# EAGLE schematic pork pi (EAGLE 6.5.0)
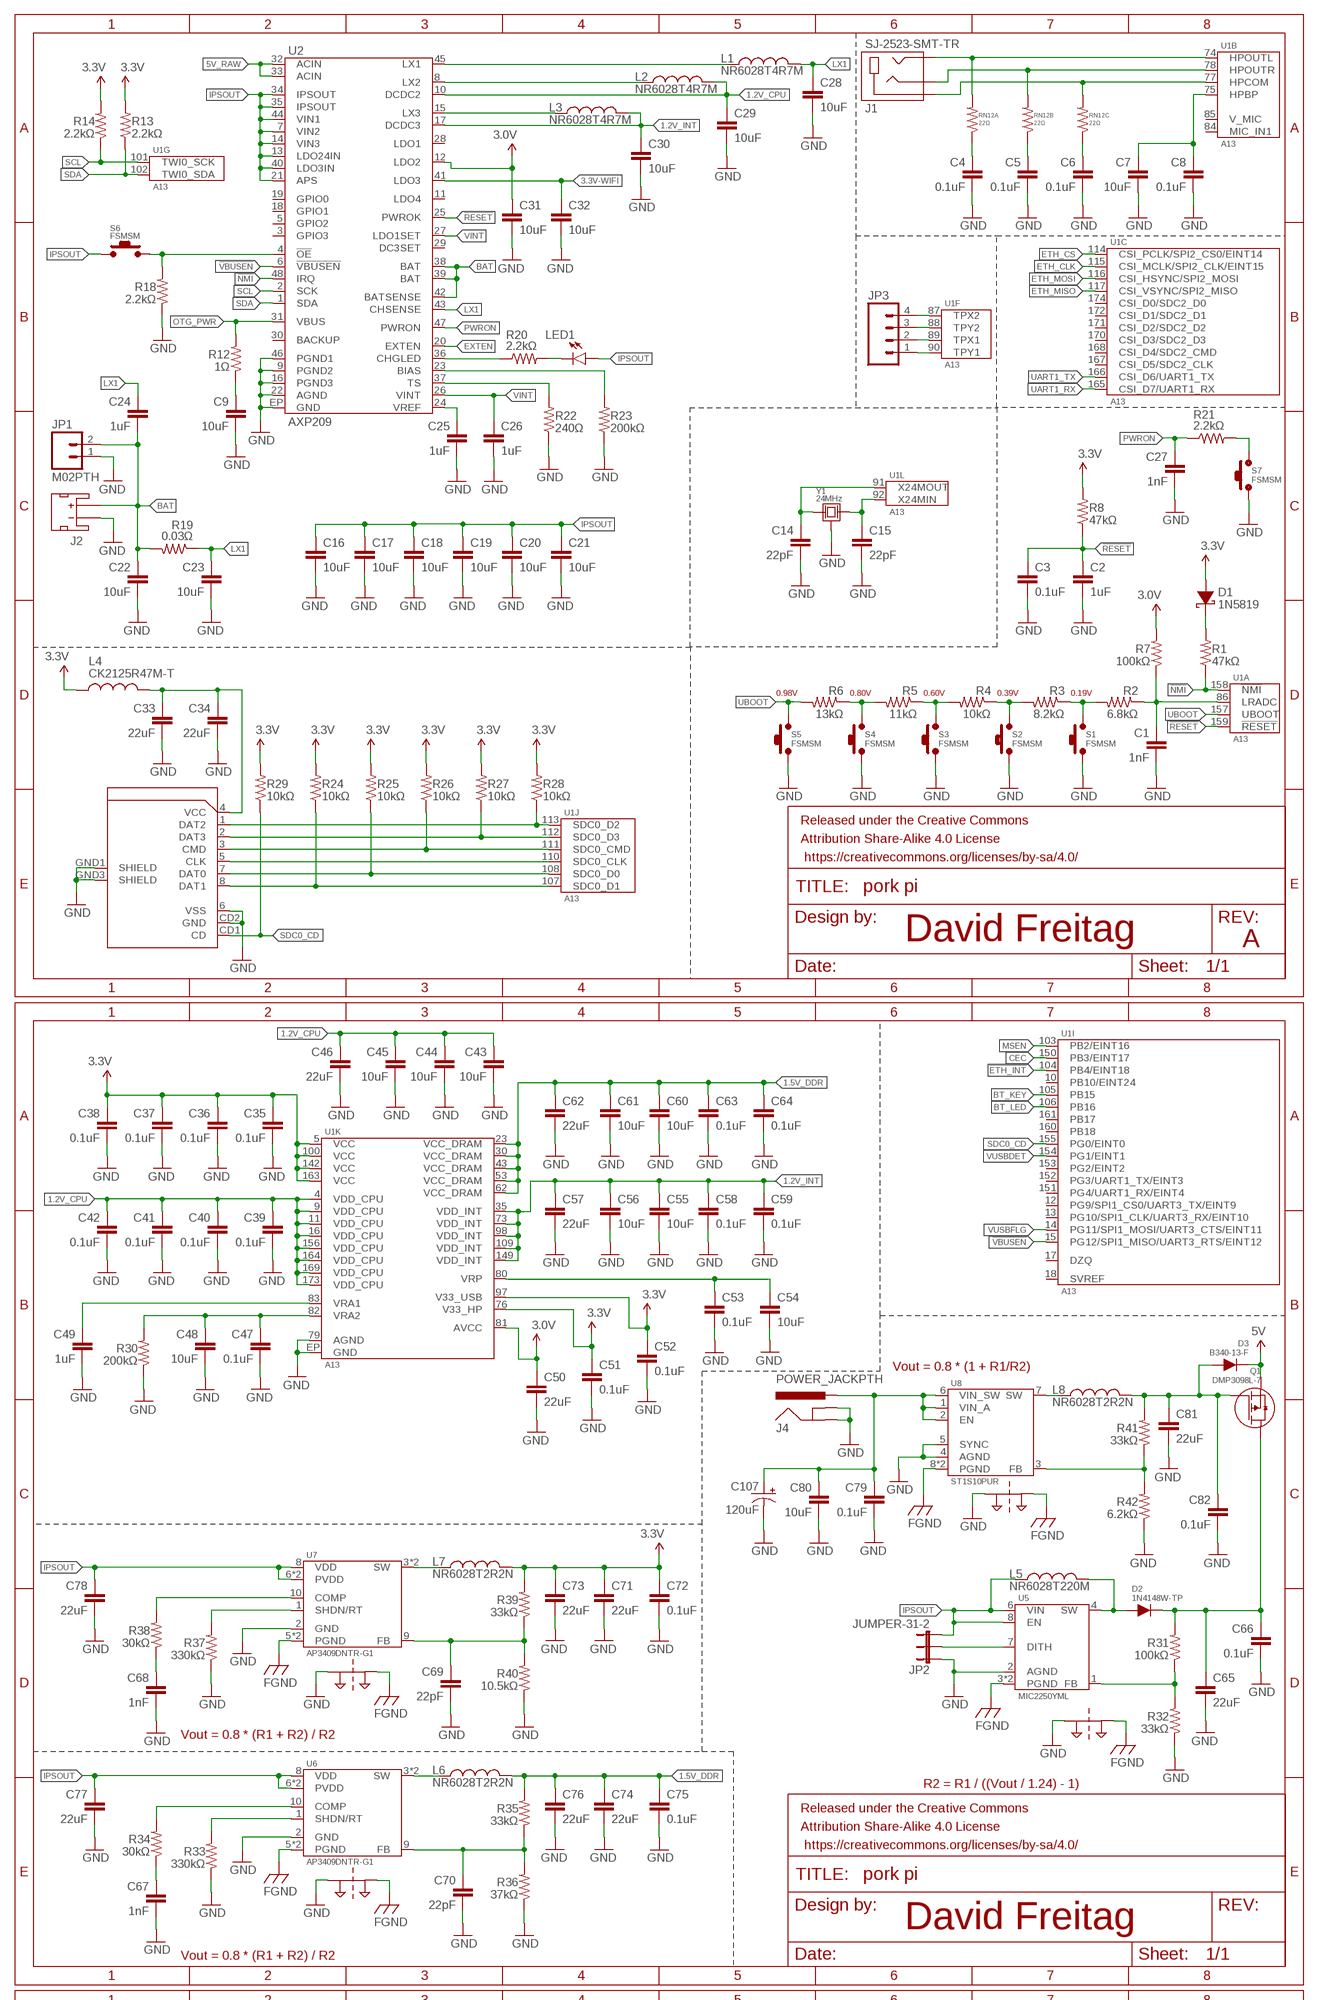
[diagram p0: schematic, sheet 1, part 1 of 3]
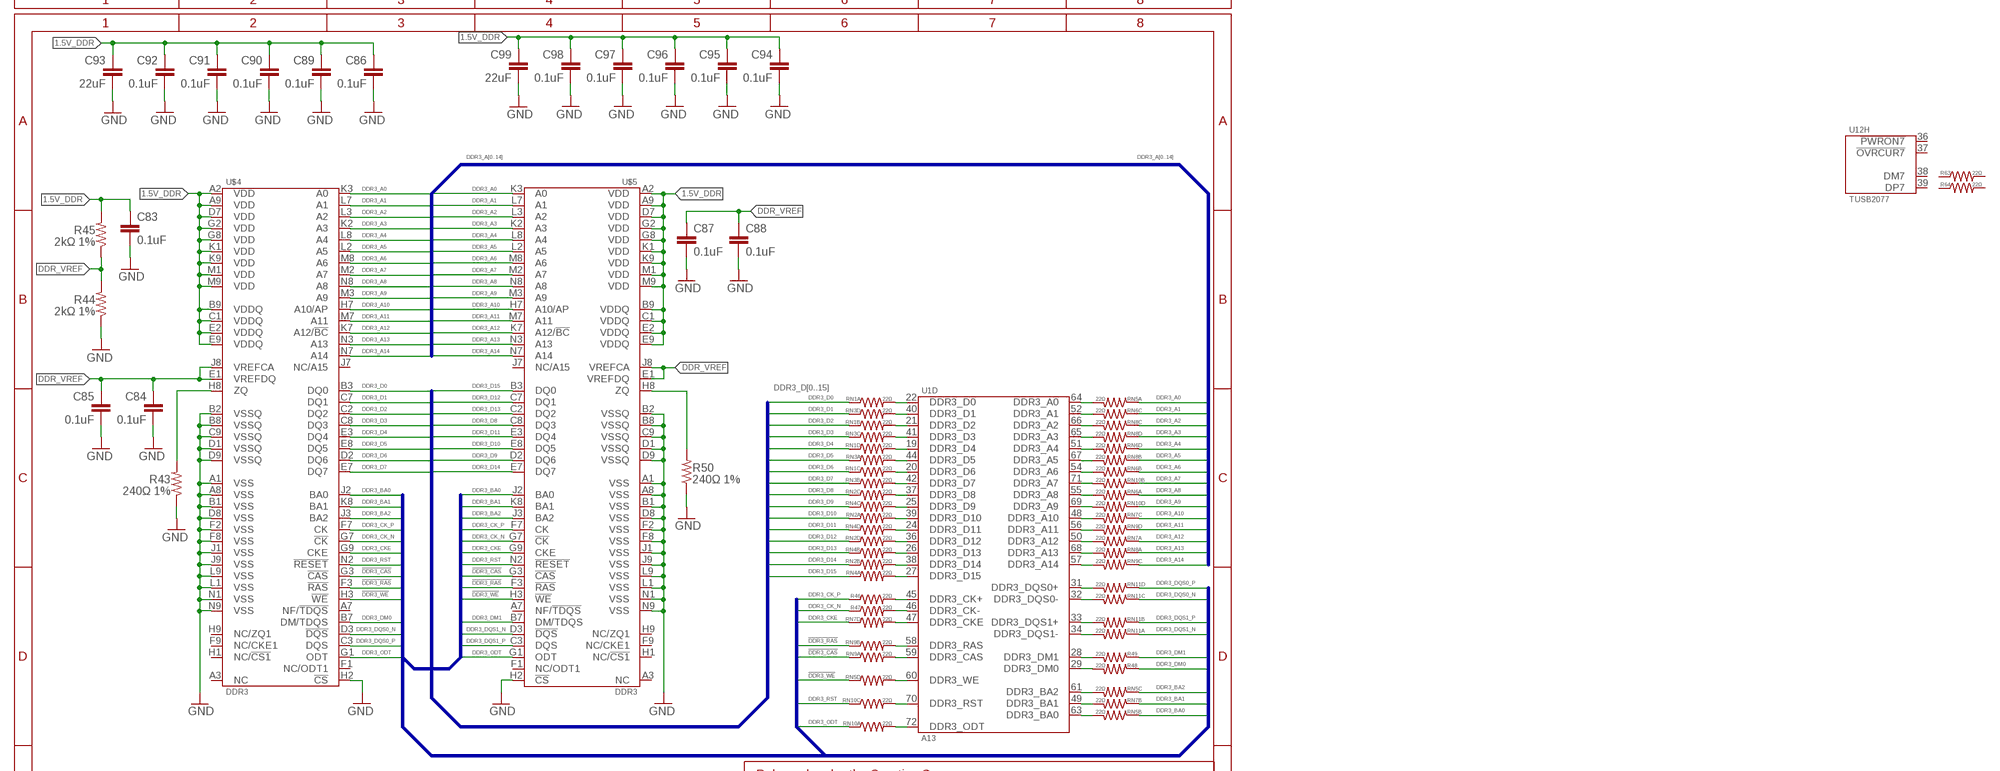
[diagram p1: schematic, sheet 1, part 2 of 3]
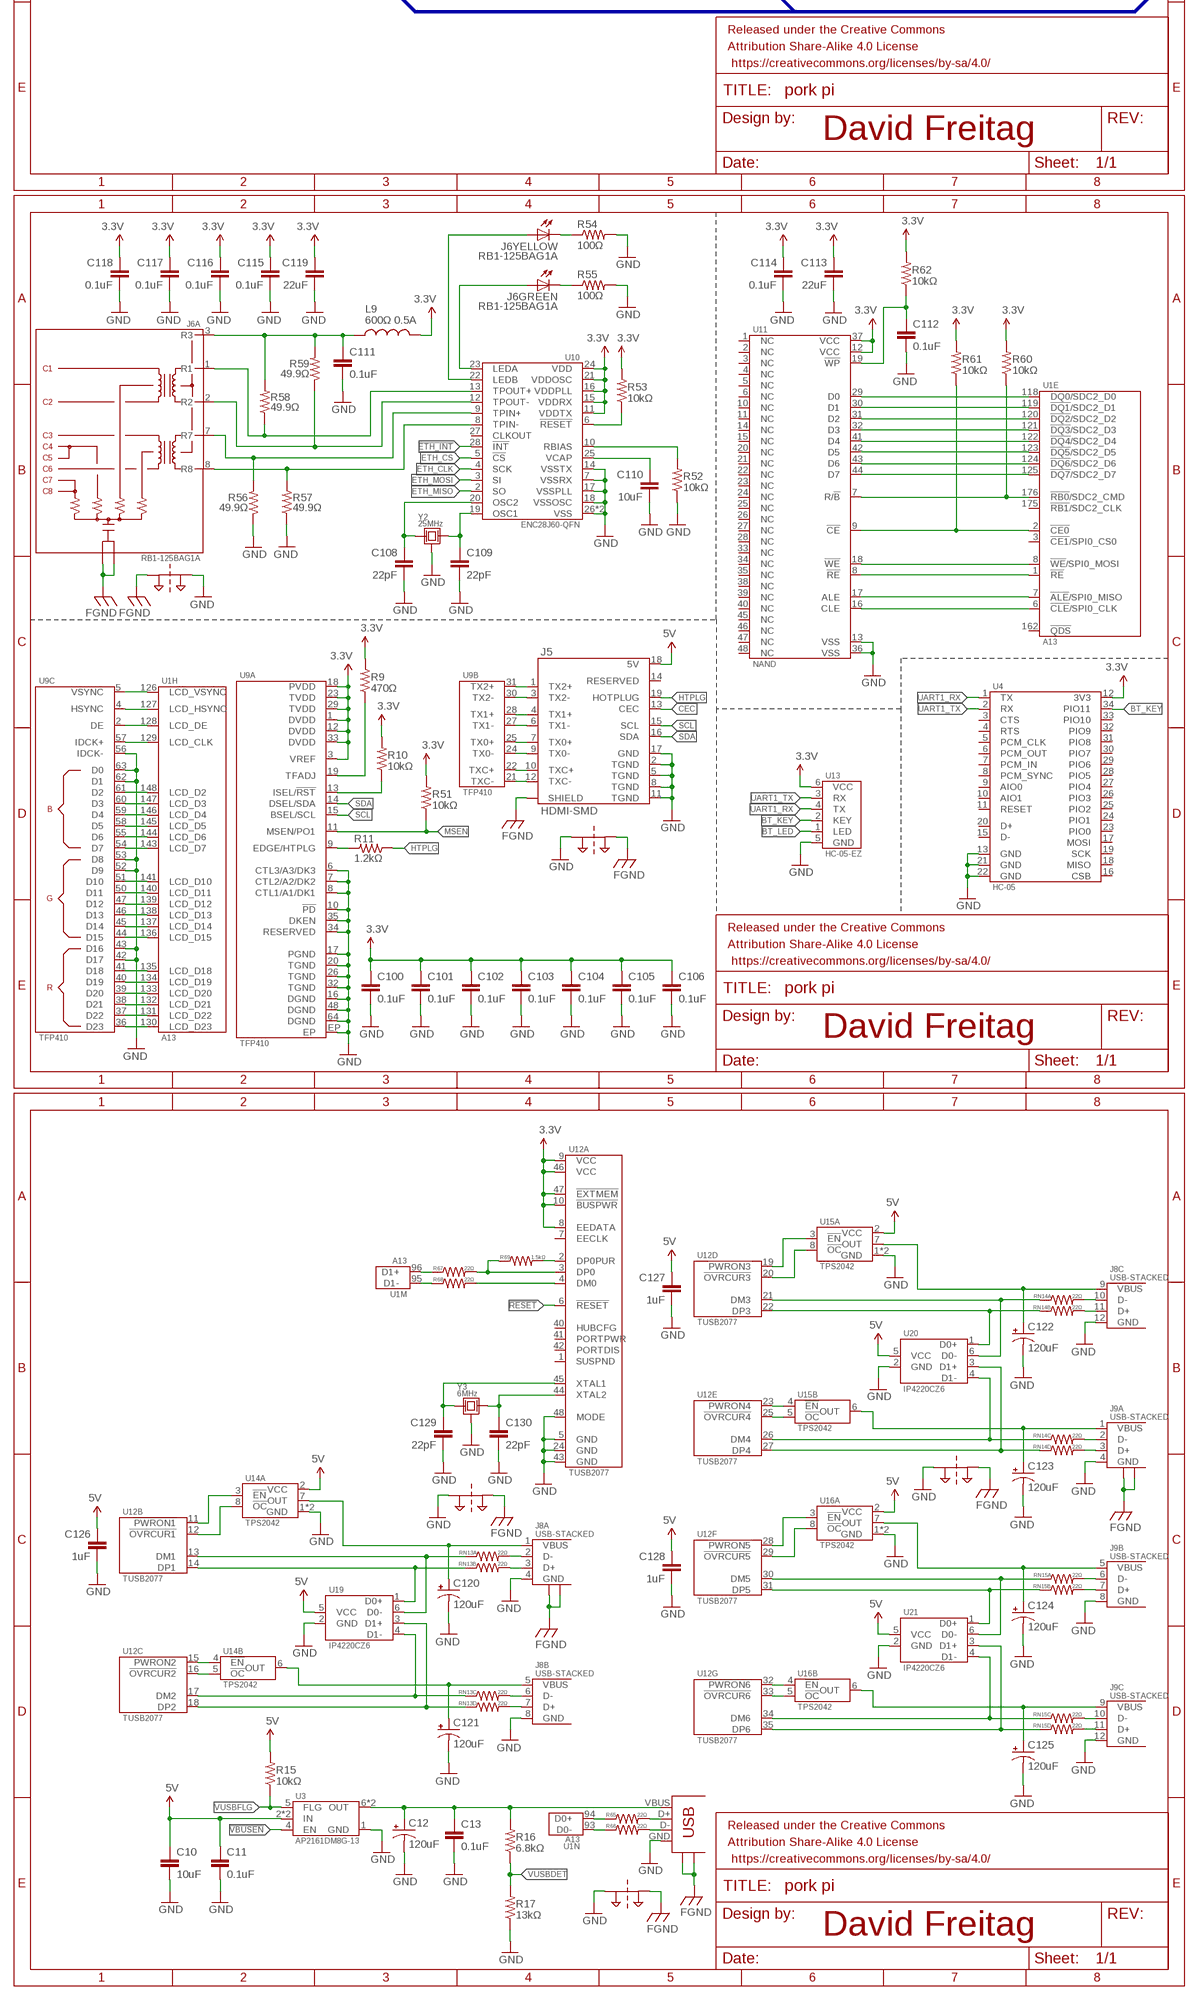
[diagram p2: schematic, sheet 1, part 3 of 3]

## Parts
C1  1nF  CAP0402-CAP  [0402-CAP]
C2  1uF  CAP0402-CAP  [0402-CAP]
C3  0.1uF  CAP0402-CAP  [0402-CAP]
C4  0.1uF  CAP0402-CAP  [0402-CAP]
C5  0.1uF  CAP0402-CAP  [0402-CAP]
C6  0.1uF  CAP0402-CAP  [0402-CAP]
C7  10uF  CAP0603-CAP  [0603-CAP]
C8  0.1uF  CAP0402-CAP  [0402-CAP]
C9  10uF  CAP0603-CAP  [0603-CAP]
C10  10uF  CAP0603-CAP  [0603-CAP]
C11  0.1uF  CAP0402-CAP  [0402-CAP]
C12  120uF  CAP_POL-POLYMER_6.5  [CAP_POLYMER-6.5X6.5]
C13  0.1uF  CAP0402-CAP  [0402-CAP]
C14  22pF  CAP0402-CAP  [0402-CAP]
C15  22pF  CAP0402-CAP  [0402-CAP]
C16  10uF  CAP0603-CAP  [0603-CAP]
C17  10uF  CAP0603-CAP  [0603-CAP]
C18  10uF  CAP0603-CAP  [0603-CAP]
C19  10uF  CAP0603-CAP  [0603-CAP]
C20  10uF  CAP0603-CAP  [0603-CAP]
C21  10uF  CAP0603-CAP  [0603-CAP]
C22  10uF  CAP0603-CAP  [0603-CAP]
C23  10uF  CAP0603-CAP  [0603-CAP]
C24  1uF  CAP0402-CAP  [0402-CAP]
C25  1uF  CAP0402-CAP  [0402-CAP]
C26  1uF  CAP0402-CAP  [0402-CAP]
C27  1nF  CAP0402-CAP  [0402-CAP]
C28  10uF  CAP0603-CAP  [0603-CAP]
C29  10uF  CAP0603-CAP  [0603-CAP]
C30  10uF  CAP0603-CAP  [0603-CAP]
C31  10uF  CAP0603-CAP  [0603-CAP]
C32  10uF  CAP0603-CAP  [0603-CAP]
C33  22uF  CAP0603-CAP  [0603-CAP]
C34  22uF  CAP0603-CAP  [0603-CAP]
C35  0.1uF  CAP0402-CAP  [0402-CAP]
C36  0.1uF  CAP0402-CAP  [0402-CAP]
C37  0.1uF  CAP0402-CAP  [0402-CAP]
C38  0.1uF  CAP0402-CAP  [0402-CAP]
C39  0.1uF  CAP0402-CAP  [0402-CAP]
C40  0.1uF  CAP0402-CAP  [0402-CAP]
C41  0.1uF  CAP0402-CAP  [0402-CAP]
C42  0.1uF  CAP0402-CAP  [0402-CAP]
C43  10uF  CAP0603-CAP  [0603-CAP]
C44  10uF  CAP0603-CAP  [0603-CAP]
C45  10uF  CAP0603-CAP  [0603-CAP]
C46  22uF  CAP0603-CAP  [0603-CAP]
C47  0.1uF  CAP0402-CAP  [0402-CAP]
C48  10uF  CAP0603-CAP  [0603-CAP]
C49  1uF  CAP0402-CAP  [0402-CAP]
C50  22uF  CAP0603-CAP  [0603-CAP]
C51  0.1uF  CAP0402-CAP  [0402-CAP]
C52  0.1uF  CAP0402-CAP  [0402-CAP]
C53  0.1uF  CAP0402-CAP  [0402-CAP]
C54  10uF  CAP0603-CAP  [0603-CAP]
C55  10uF  CAP0603-CAP  [0603-CAP]
C56  10uF  CAP0603-CAP  [0603-CAP]
C57  22uF  CAP0603-CAP  [0603-CAP]
C58  0.1uF  CAP0402-CAP  [0402-CAP]
C59  0.1uF  CAP0402-CAP  [0402-CAP]
C60  10uF  CAP0603-CAP  [0603-CAP]
C61  10uF  CAP0603-CAP  [0603-CAP]
C62  22uF  CAP0603-CAP  [0603-CAP]
C63  0.1uF  CAP0402-CAP  [0402-CAP]
C64  0.1uF  CAP0402-CAP  [0402-CAP]
C65  22uF  CAP0603-CAP  [0603-CAP]
C66  0.1uF  CAP0402-CAP  [0402-CAP]
C67  1nF  CAP0402-CAP  [0402-CAP]
C68  1nF  CAP0402-CAP  [0402-CAP]
C69  22pF  CAP0402-CAP  [0402-CAP]
C70  22pF  CAP0402-CAP  [0402-CAP]
C71  22uF  CAP0603-CAP  [0603-CAP]
C72  0.1uF  CAP0402-CAP  [0402-CAP]
C73  22uF  CAP0603-CAP  [0603-CAP]
C74  22uF  CAP0603-CAP  [0603-CAP]
C75  0.1uF  CAP0402-CAP  [0402-CAP]
C76  22uF  CAP0603-CAP  [0603-CAP]
C77  22uF  CAP0603-CAP  [0603-CAP]
C78  22uF  CAP0603-CAP  [0603-CAP]
C79  0.1uF  CAP0402-CAP  [0402-CAP]
C80  10uF  CAP0603-CAP  [0603-CAP]
C81  22uF  CAP0603-CAP  [0603-CAP]
C82  0.1uF  CAP0402-CAP  [0402-CAP]
C83  0.1uF  CAP0402-CAP  [0402-CAP]
C84  0.1uF  CAP0402-CAP  [0402-CAP]
C85  0.1uF  CAP0402-CAP  [0402-CAP]
C86  0.1uF  CAP0402-CAP  [0402-CAP]
C87  0.1uF  CAP0402-CAP  [0402-CAP]
C88  0.1uF  CAP0402-CAP  [0402-CAP]
C89  0.1uF  CAP0402-CAP  [0402-CAP]
C90  0.1uF  CAP0402-CAP  [0402-CAP]
C91  0.1uF  CAP0402-CAP  [0402-CAP]
C92  0.1uF  CAP0402-CAP  [0402-CAP]
C93  22uF  CAP0603-CAP  [0603-CAP]
C94  0.1uF  CAP0402-CAP  [0402-CAP]
C95  0.1uF  CAP0402-CAP  [0402-CAP]
C96  0.1uF  CAP0402-CAP  [0402-CAP]
C97  0.1uF  CAP0402-CAP  [0402-CAP]
C98  0.1uF  CAP0402-CAP  [0402-CAP]
C99  22uF  CAP0603-CAP  [0603-CAP]
C100  0.1uF  CAP0402-CAP  [0402-CAP]
C101  0.1uF  CAP0402-CAP  [0402-CAP]
C102  0.1uF  CAP0402-CAP  [0402-CAP]
C103  0.1uF  CAP0402-CAP  [0402-CAP]
C104  0.1uF  CAP0402-CAP  [0402-CAP]
C105  0.1uF  CAP0402-CAP  [0402-CAP]
C106  0.1uF  CAP0402-CAP  [0402-CAP]
C107  120uF  CAP_POL-POLYMER_6.5  [CAP_POLYMER-6.5X6.5]
C108  22pF  CAP0402-CAP  [0402-CAP]
C109  22pF  CAP0402-CAP  [0402-CAP]
C110  10uF  CAP0603-CAP  [0603-CAP]
C111  0.1uF  CAP0402-CAP  [0402-CAP]
C112  0.1uF  CAP0402-CAP  [0402-CAP]
C113  22uF  CAP0603-CAP  [0603-CAP]
C114  0.1uF  CAP0402-CAP  [0402-CAP]
C115  0.1uF  CAP0402-CAP  [0402-CAP]
C116  0.1uF  CAP0402-CAP  [0402-CAP]
C117  0.1uF  CAP0402-CAP  [0402-CAP]
C118  0.1uF  CAP0402-CAP  [0402-CAP]
C119  22uF  CAP0603-CAP  [0603-CAP]
C120  120uF  CAP_POL-POLYMER_6.5  [CAP_POLYMER-6.5X6.5]
C121  120uF  CAP_POL-POLYMER_6.5  [CAP_POLYMER-6.5X6.5]
C122  120uF  CAP_POL-POLYMER_6.5  [CAP_POLYMER-6.5X6.5]
C123  120uF  CAP_POL-POLYMER_6.5  [CAP_POLYMER-6.5X6.5]
C124  120uF  CAP_POL-POLYMER_6.5  [CAP_POLYMER-6.5X6.5]
C125  120uF  CAP_POL-POLYMER_6.5  [CAP_POLYMER-6.5X6.5]
C126  1uF  CAP0402-CAP  [0402-CAP]
C127  1uF  CAP0402-CAP  [0402-CAP]
C128  1uF  CAP0402-CAP  [0402-CAP]
C129  22pF  CAP0402-CAP  [0402-CAP]
C130  22pF  CAP0402-CAP  [0402-CAP]
D1  1N5819  1N5819-SOD123  [SOD123]
D2  1N4148W-TP  DIODE  [SOD-123]
D3  B340-13-F  [SMC]
J1  SJ-2523-SMT-TR  [SJ-2523-SMT-TR]
J2  JST_2MM_MALE  [JST-2-SMD]
J3  MICRO-SD  [MICRO-SD-SOCKET-PP]
J4  POWER_JACKPTH  [POWER_JACK_PTH]
J5  HDMI-SMD  [HDMI-SMD]
J6  RB1-125BAG1A  [ETHERNET]
J7  USB+SHIELD-MICROB  [USB-MICROB]
J8  USB-STACKED  [USB-STACKED]
J9  USB-STACKED  [USB-STACKED]
JP1  M02PTH  [1X02]
JP2  JUMPER-31-2  [SJ_3_PASTE1&2]
JP3  M04PTH  [1X04]
L1  NR6028T4R7M  [NR6028T4R7M]
L2  NR6028T4R7M  [NR6028T4R7M]
L3  NR6028T4R7M  [NR6028T4R7M]
L4  CK2125R47M-T  INDUCTOR0805  [0805]
L5  NR6028T220M  NR6028T4R7M  [NR6028T4R7M]
L6  NR6028T2R2N  NR6028T4R7M  [NR6028T4R7M]
L7  NR6028T2R2N  NR6028T4R7M  [NR6028T4R7M]
L8  NR6028T2R2N  NR6028T4R7M  [NR6028T4R7M]
L9  600Ω 0.5A  INDUCTOR0805  [0805]
LED1  LED1206  [LED-1206]
PT1  2PT_GND_TIE  [2PT_GND_TIE]
PT2  2PT_GND_TIE  [2PT_GND_TIE]
PT3  2PT_GND_TIE  [2PT_GND_TIE]
PT4  2PT_GND_TIE  [2PT_GND_TIE]
PT5  2PT_GND_TIE  [2PT_GND_TIE]
PT6  2PT_GND_TIE  [2PT_GND_TIE]
PT7  2PT_GND_TIE  [2PT_GND_TIE]
PT8  2PT_GND_TIE  [2PT_GND_TIE]
PT9  2PT_GND_TIE  [2PT_GND_TIE]
Q1  DMP3098L-7  [SOT23-3]
R1  47kΩ  RESISTOR0402-RES  [0402-RES]
R2  6.8kΩ  RESISTOR0402-RES  [0402-RES]
R3  8.2kΩ  RESISTOR0402-RES  [0402-RES]
R4  10kΩ  RESISTOR0402-RES  [0402-RES]
R5  11kΩ  RESISTOR0402-RES  [0402-RES]
R6  13kΩ  RESISTOR0402-RES  [0402-RES]
R7  100kΩ  RESISTOR0402-RES  [0402-RES]
R8  47kΩ  RESISTOR0402-RES  [0402-RES]
R9  470Ω  RESISTOR0402-RES  [0402-RES]
R10  10kΩ  RESISTOR0402-RES  [0402-RES]
R11  1.2kΩ  RESISTOR0402-RES  [0402-RES]
R12  1Ω  RESISTOR0402-RES  [0402-RES]
R13  2.2kΩ  RESISTOR0402-RES  [0402-RES]
R14  2.2kΩ  RESISTOR0402-RES  [0402-RES]
R15  10kΩ  RESISTOR0402-RES  [0402-RES]
R16  6.8kΩ  RESISTOR0402-RES  [0402-RES]
R17  13kΩ  RESISTOR0402-RES  [0402-RES]
R18  2.2kΩ  RESISTOR0402-RES  [0402-RES]
R19  0.03Ω  RESISTOR0805-RES  [0805]
R20  2.2kΩ  RESISTOR0402-RES  [0402-RES]
R21  2.2kΩ  RESISTOR0402-RES  [0402-RES]
R22  240Ω  RESISTOR0402-RES  [0402-RES]
R23  200kΩ  RESISTOR0402-RES  [0402-RES]
R24  10kΩ  RESISTOR0402-RES  [0402-RES]
R25  10kΩ  RESISTOR0402-RES  [0402-RES]
R26  10kΩ  RESISTOR0402-RES  [0402-RES]
R27  10kΩ  RESISTOR0402-RES  [0402-RES]
R28  10kΩ  RESISTOR0402-RES  [0402-RES]
R29  10kΩ  RESISTOR0402-RES  [0402-RES]
R30  200kΩ  RESISTOR0402-RES  [0402-RES]
R31  100kΩ  RESISTOR0402-RES  [0402-RES]
R32  33kΩ  RESISTOR0402-RES  [0402-RES]
R33  330kΩ  RESISTOR0402-RES  [0402-RES]
R34  30kΩ  RESISTOR0402-RES  [0402-RES]
R35  33kΩ  RESISTOR0402-RES  [0402-RES]
R36  37kΩ  RESISTOR0402-RES  [0402-RES]
R37  330kΩ  RESISTOR0402-RES  [0402-RES]
R38  30kΩ  RESISTOR0402-RES  [0402-RES]
R39  33kΩ  RESISTOR0402-RES  [0402-RES]
R40  10.5kΩ  RESISTOR0402-RES  [0402-RES]
R41  33kΩ  RESISTOR0402-RES  [0402-RES]
R42  6.2kΩ  RESISTOR0402-RES  [0402-RES]
R43  240Ω 1%  RESISTOR0402-RES  [0402-RES]
R44  2kΩ 1%  RESISTOR0402-RES  [0402-RES]
R45  2kΩ 1%  RESISTOR0402-RES  [0402-RES]
R46  22Ω  RESISTOR0402-RES  [0402-RES]
R47  22Ω  RESISTOR0402-RES  [0402-RES]
R48  22Ω  RESISTOR0402-RES  [0402-RES]
R49  22Ω  RESISTOR0402-RES  [0402-RES]
R50  240Ω 1%  RESISTOR0402-RES  [0402-RES]
R51  10kΩ  RESISTOR0402-RES  [0402-RES]
R52  10kΩ  RESISTOR0402-RES  [0402-RES]
R53  10kΩ  RESISTOR0402-RES  [0402-RES]
R54  100Ω  RESISTOR0402-RES  [0402-RES]
R55  100Ω  RESISTOR0402-RES  [0402-RES]
R56  49.9Ω  RESISTOR0805-RES  [0805]
R57  49.9Ω  RESISTOR0805-RES  [0805]
R58  49.9Ω  RESISTOR0805-RES  [0805]
R59  49.9Ω  RESISTOR0805-RES  [0805]
R60  10kΩ  RESISTOR0402-RES  [0402-RES]
R61  10kΩ  RESISTOR0402-RES  [0402-RES]
R62  10kΩ  RESISTOR0402-RES  [0402-RES]
R63  22Ω  RESISTOR0402-RES  [0402-RES]
R64  22Ω  RESISTOR0402-RES  [0402-RES]
R65  22Ω  RESISTOR0402-RES  [0402-RES]
R66  22Ω  RESISTOR0402-RES  [0402-RES]
R67  22Ω  RESISTOR0402-RES  [0402-RES]
R68  22Ω  RESISTOR0402-RES  [0402-RES]
R69  1.5kΩ  RESISTOR0402-RES  [0402-RES]
RN1  22Ω  RESISTOR-NETWORK-1206  [RESISTOR_NETWORK-1206]
RN2  22Ω  RESISTOR-NETWORK-1206  [RESISTOR_NETWORK-1206]
RN3  22Ω  RESISTOR-NETWORK-1206  [RESISTOR_NETWORK-1206]
RN4  22Ω  RESISTOR-NETWORK-1206  [RESISTOR_NETWORK-1206]
RN5  22Ω  RESISTOR-NETWORK-1206  [RESISTOR_NETWORK-1206]
RN6  22Ω  RESISTOR-NETWORK-1206  [RESISTOR_NETWORK-1206]
RN7  22Ω  RESISTOR-NETWORK-1206  [RESISTOR_NETWORK-1206]
RN8  22Ω  RESISTOR-NETWORK-1206  [RESISTOR_NETWORK-1206]
RN9  22Ω  RESISTOR-NETWORK-1206  [RESISTOR_NETWORK-1206]
RN10  22Ω  RESISTOR-NETWORK-1206  [RESISTOR_NETWORK-1206]
RN11  22Ω  RESISTOR-NETWORK-1206  [RESISTOR_NETWORK-1206]
RN12  22Ω  RESISTOR-NETWORK-1206  [RESISTOR_NETWORK-1206]
RN13  22Ω  RESISTOR-NETWORK-1206  [RESISTOR_NETWORK-1206]
RN14  22Ω  RESISTOR-NETWORK-1206  [RESISTOR_NETWORK-1206]
RN15  22Ω  RESISTOR-NETWORK-1206  [RESISTOR_NETWORK-1206]
S1  FSMSM  [FSMSM]
S2  FSMSM  [FSMSM]
S3  FSMSM  [FSMSM]
S4  FSMSM  [FSMSM]
S5  FSMSM  [FSMSM]
S6  FSMSM  [FSMSM]
S7  FSMSM  [FSMSM]
U1  A13  [A13]
U2  AXP209  [QFN-48]
U3  AP2161DM8G-13  [MSOP-8]
U4  HC-05  [HC-05]
U5  MIC2250YML  [MLF-8]
U6  AP3409DNTR-G1  [UDFN-10]
U7  AP3409DNTR-G1  [UDFN-10]
U8  ST1S10PUR  [DFN-8]
U9  TFP410  [PQFP-64]
U10  ENC28J60-QFN  [QFN-28]
U11  NAND  [TSOP1-48]
U12  TUSB2077  [LQFP-48]
U13  HC-05-EZ  [M06X1]
U14  TPS2042  [SON-8]
U15  TPS2042  [SON-8]
U16  TPS2042  [SON-8]
U19  IP4220CZ6  [SOT-6]
U20  IP4220CZ6  [SOT-6]
U21  IP4220CZ6  [SOT-6]
U$4  DDR3  [DDR3_78]
U$5  DDR3  [DDR3_78]
Y1  24MHz  CRYSTAL-3.2X2.5  [FA-238]
Y2  25MHz  CRYSTAL-3.2X2.5  [FA-238]
Y3  6MHz  CRYSTAL-3.2X2.5  [FA-238]

## Nets
1.2V_CPU: C29.1 C39.1 C40.1 C41.1 C42.1 C43.1 C44.1 C45.1 C46.1 L2.2 U1.4(K:VDD_CPU) U1.9(K:VDD_CPU) U1.11(K:VDD_CPU) U1.16(K:VDD_CPU) U1.156(K:VDD_CPU) U1.164(K:VDD_CPU) U1.169(K:VDD_CPU) U1.173(K:VDD_CPU) U2.10(DCDC2)
1.2V_INT: C30.1 C55.1 C56.1 C57.1 C58.1 C59.1 L3.2 U1.35(K:VDD_INT) U1.73(K:VDD_INT) U1.98(K:VDD_INT) U1.109(K:VDD_INT) U1.149(K:VDD_INT) U2.17(DCDC3)
1.5V_DDR: C60.1 C61.1 C62.1 C63.1 C64.1 C74.1 C75.1 C76.1 C83.1 C86.1 C89.1 C90.1 C91.1 C92.1 C93.1 C94.1 C95.1 C96.1 C97.1 C98.1 C99.1 L6.2 R35.2 R45.2 U1.23(K:VCC_DRAM) U1.30(K:VCC_DRAM) U1.43(K:VCC_DRAM) U1.53(K:VCC_DRAM) U1.62(K:VCC_DRAM) U$4.A2(VDD) U$4.A9(VDD) U$4.B9(VDDQ) U$4.C1(VDDQ) U$4.D7(VDD) U$4.E2(VDDQ) U$4.E9(VDDQ) U$4.G2(VDD) U$4.G8(VDD) U$4.K1(VDD) U$4.K9(VDD) U$4.M1(VDD) U$4.M9(VDD) U$5.A2(VDD) U$5.A9(VDD) U$5.B9(VDDQ) U$5.C1(VDDQ) U$5.D7(VDD) U$5.E2(VDDQ) U$5.E9(VDDQ) U$5.G2(VDD) U$5.G8(VDD) U$5.K1(VDD) U$5.K9(VDD) U$5.M1(VDD) U$5.M9(VDD)
3.0V: C31.1 C50.1 R7.2 U1.81(K:AVCC) U2.12(LDO2)
3.3V: C35.1 C36.1 C37.1 C38.1 C51.1 C52.1 C71.1 C72.1 C73.1 C100.1 C101.1 C102.1 C103.1 C104.1 C105.1 C106.1 C113.1 C114.1 C115.1 C116.1 C117.1 C118.1 C119.1 D1.ANODE L4.1 L7.2 L9.2 R8.2 R9.2 R10.2 R13.2 R14.2 R24.2 R25.2 R26.2 R27.2 R28.2 R29.2 R39.2 R51.2 R53.2 R60.2 R61.2 R62.2 U1.5(K:VCC) U1.76(K:V33_HP) U1.97(K:V33_USB) U1.100(K:VCC) U1.142(K:VCC) U1.163(K:VCC) U4.12(3V3) U9.1(A:DVDD) U9.3(A:VREF) U9.12(A:DVDD) U9.18(A:PVDD) U9.23(A:TVDD) U9.29(A:TVDD) U9.33(A:DVDD) U10.11(VDDTX) U10.15(VDDRX) U10.16(VDDPLL) U10.21(VDDOSC) U10.24(VDD) U11.12(VCC) U11.37(VCC) U12.8(A:EEDATA) U12.9(A:VCC) U12.10(A:!BUSPWR) U12.46(A:VCC) U12.47(A:!EXTMEM) U13.6(VCC)
3.3V-WIFI: C32.1 U2.41(LDO3)
5V: C10.1 C11.1 C126.1 C127.1 C128.1 D3.C J5.18(5V) Q1.2(S) R15.2 U3.2(IN) U3.3(IN) U14.2(A:VCC) U15.2(A:VCC) U16.2(A:VCC) U19.5(VCC) U20.5(VCC) U21.5(VCC)
5V_RAW: U2.32(ACIN) U2.33(ACIN)
!DDR3_CAS!: RN9.1 U$4.G3(!CAS) U$5.G3(!CAS)
!DDR3_RAS!: RN9.2 U$4.F3(!RAS) U$5.F3(!RAS)
!DDR3_WE!: RN5.4 U$4.H3(!WE) U$5.H3(!WE)
!ETH_INT: U1.104(I:PB4/EINT18) U10.28(!INT)
!NMI: R1.1 U1.158(A:!NMI) U2.48(IRQ)
!RESET: C2.1 C3.1 R8.1 U1.159(A:!RESET) U2.25(PWROK) U12.6(A:!RESET)
!VBUSEN: U1.15(I:PG12/SPI1_MISO/UART3_RTS/EINT12) U2.6(!VBUSEN) U3.4(EN)
BAT: C22.1 C24.2 J2.2(+) JP1.2 R19.2 U2.38(BAT) U2.39(BAT) U2.42(BATSENSE)
BT_KEY: U1.105(I:PB15) U4.34(PIO11) U13.2(KEY)
BT_LED: U1.106(I:PB16) U13.1(LED)
CEC: J5.13(CEC) U1.150(I:PB3/EINT17)
D0_N: R66.1 U1.93(N:D0-)
D0_P: R65.1 U1.94(N:D0+)
D1_N: R68.1 U1.95(M:D1-)
D1_P: R67.1 U1.96(M:D1+)
D2_N: RN13.1 U12.13(B:DM1) U19.6(D0-)
D2_P: RN13.2 U12.14(B:DP1) U19.1(D0+)
D3_N: RN13.3 U12.17(C:DM2) U19.4(D1-)
D3_P: RN13.4 U12.18(C:DP2) U19.3(D1+)
D4_N: RN14.1 U12.21(D:DM3) U20.6(D0-)
D4_P: RN14.2 U12.22(D:DP3) U20.1(D0+)
D5_N: RN14.3 U12.26(E:DM4) U20.4(D1-)
D5_P: RN14.4 U12.27(E:DP4) U20.3(D1+)
D6_N: RN15.1 U12.30(F:DM5) U21.6(D0-)
D6_P: RN15.2 U12.31(F:DP5) U21.1(D0+)
D7_N: RN15.3 U12.34(G:DM6) U21.4(D1-)
D7_P: RN15.4 U12.35(G:DP6) U21.3(D1+)
DDR3_A0: RN5.1 U$4.K3(A0) U$5.K3(A0)
DDR3_A1: RN6.3 U$4.L7(A1) U$5.L7(A1)
DDR3_A2: RN8.3 U$4.L3(A2) U$5.L3(A2)
DDR3_A3: RN8.4 U$4.K2(A3) U$5.K2(A3)
DDR3_A4: RN6.4 U$4.L8(A4) U$5.L8(A4)
DDR3_A5: RN8.2 U$4.L2(A5) U$5.L2(A5)
DDR3_A6: RN6.2 U$4.M8(A6) U$5.M8(A6)
DDR3_A7: RN10.2 U$4.M2(A7) U$5.M2(A7)
DDR3_A8: RN6.1 U$4.N8(A8) U$5.N8(A8)
DDR3_A9: RN10.4 U$4.M3(A9) U$5.M3(A9)
DDR3_A10: RN7.3 U$4.H7(A10/AP) U$5.H7(A10/AP)
DDR3_A11: RN9.4 U$4.M7(A11) U$5.M7(A11)
DDR3_A12: RN7.1 U$4.K7(A12/!BC) U$5.K7(A12/!BC)
DDR3_A13: RN8.1 U$4.N3(A13) U$5.N3(A13)
DDR3_A14: RN9.3 U$4.N7(A14) U$5.N7(A14)
DDR3_BA0: RN5.2 U$4.J2(BA0) U$5.J2(BA0)
DDR3_BA1: RN7.2 U$4.K8(BA1) U$5.K8(BA1)
DDR3_BA2: RN5.3 U$4.J3(BA2) U$5.J3(BA2)
DDR3_CK_N: R47.1 U$4.G7(!CK) U$5.G7(!CK)
DDR3_CK_P: R46.1 U$4.F7(CK) U$5.F7(CK)
DDR3_CKE: RN7.4 U$4.G9(CKE) U$5.G9(CKE)
DDR3_D0: RN1.1 U$4.B3(DQ0)
DDR3_D1: RN3.4 U$4.C7(DQ1)
DDR3_D2: RN1.2 U$4.C2(DQ2)
DDR3_D3: RN3.3 U$4.C8(DQ3)
DDR3_D4: RN1.4 U$4.E3(DQ4)
DDR3_D5: RN3.1 U$4.E8(DQ5)
DDR3_D6: RN1.3 U$4.D2(DQ6)
DDR3_D7: RN3.2 U$4.E7(DQ7)
DDR3_D8: RN2.3 U$5.C8(DQ3)
DDR3_D9: RN4.3 U$5.D2(DQ6)
DDR3_D10: RN2.1 U$5.E8(DQ5)
DDR3_D11: RN4.4 U$5.E3(DQ4)
DDR3_D12: RN2.4 U$5.C7(DQ1)
DDR3_D13: RN4.2 U$5.C2(DQ2)
DDR3_D14: RN2.2 U$5.E7(DQ7)
DDR3_D15: RN4.1 U$5.B3(DQ0)
DDR3_DM0: R48.1 U$4.B7(DM/TDQS)
DDR3_DM1: R49.1 U$5.B7(DM/TDQS)
DDR3_DQS0_N: RN11.3 U$4.D3(!DQS)
DDR3_DQS0_P: RN11.4 U$4.C3(DQS)
DDR3_DQS1_N: RN11.1 U$5.D3(!DQS)
DDR3_DQS1_P: RN11.2 U$5.C3(DQS)
DDR3_ODT: RN10.1 U$4.G1(ODT) U$5.G1(ODT)
DDR3_RST: RN10.3 U$4.N2(!RESET) U$5.N2(!RESET)
DDR_VREF: C84.1 C85.1 C87.1 C88.1 R44.2 R45.1 U$4.E1(VREFDQ) U$4.J8(VREFCA) U$5.E1(VREFDQ) U$5.J8(VREFCA)
ETH_CLK: U1.115(C:CSI_MCLK/SPI2_CLK/EINT15) U10.4(SCK)
ETH_CS: U1.114(C:CSI_PCLK/SPI2_CS0/EINT14) U10.5(!CS)
ETH_MISO: U1.117(C:CSI_VSYNC/SPI2_MISO) U10.2(SO)
ETH_MOSI: U1.116(C:CSI_HSYNC/SPI2_MOSI) U10.3(SI)
EXTEN: U2.20(EXTEN)
FGND: J5.P$1(SHIELD) J5.P$2(SHIELD) J5.P$3(SHIELD) J5.P$4(SHIELD) J6.P$5(A:S$1) J6.P$6(A:S$2) J7.MT1(S1) J7.MT2(S2) J7.P$1(S1) J7.P$2(S2) J8.P$1 J8.P$2 J8.P$3 J8.P$4 J9.P$1 J9.P$2 J9.P$3 J9.P$4 PT1.P$2 PT2.P$2 PT3.P$2 PT4.P$2 PT5.P$2 PT6.P$2 PT7.P$2 PT8.P$2 PT9.P$2 U5.3(PGND) U5.EP(PGND) U6.5(PGND) U6.EP(PGND) U7.5(PGND) U7.EP(PGND) U8.8(PGND) U8.EP(PGND)
GND: C1.2 C2.2 C3.2 C4.2 C5.2 C6.2 C7.2 C8.2 C9.2 C10.2 C11.2 C12.- C13.2 C14.2 C15.2 C16.2 C17.2 C18.2 C19.2 C20.2 C21.2 C22.2 C23.2 C25.2 C26.2 C27.2 C28.2 C29.2 C30.2 C31.2 C32.2 C33.2 C34.2 C35.2 C36.2 C37.2 C38.2 C39.2 C40.2 C41.2 C42.2 C43.2 C44.2 C45.2 C46.2 C47.2 C48.2 C49.2 C50.2 C51.2 C52.2 C53.2 C54.2 C55.2 C56.2 C57.2 C58.2 C59.2 C60.2 C61.2 C62.2 C63.2 C64.2 C65.2 C66.2 C67.2 C68.2 C69.2 C70.2 C71.2 C72.2 C73.2 C74.2 C75.2 C76.2 C77.2 C78.2 C79.2 C80.2 C81.2 C82.2 C83.2 C84.2 C85.2 C86.2 C87.2 C88.2 C89.2 C90.2 C91.2 C92.2 C93.2 C94.2 C95.2 C96.2 C97.2 C98.2 C99.2 C100.2 C101.2 C102.2 C103.2 C104.2 C105.2 C106.2 C107.- C108.2 C109.2 C110.2 C111.2 C112.2 C113.2 C114.2 C115.2 C116.2 C117.2 C118.2 C119.2 C120.- C121.- C122.- C123.- C124.- C125.- C126.2 C127.2 C128.2 C129.2 C130.2 J2.1(-) J3.6(VSS) J3.CD2(GND) J3.GND1(SHIELD) J3.GND3(SHIELD) J4.GND J4.GNDBREAK J5.2(TGND) J5.5(TGND) J5.8(TGND) J5.11(TGND) J5.17(GND) J7.GND J8.4(A:GND) J8.8(B:GND) J8.12(C:GND) J9.4(A:GND) J9.8(B:GND) J9.12(C:GND) JP1.1 JP2.1 PT1.P$1 PT2.P$1 PT3.P$1 PT4.P$1 PT5.P$1 PT6.P$1 PT7.P$1 PT8.P$1 PT9.P$1 R17.1 R18.1 R22.1 R23.1 R30.1 R32.1 R33.1 R36.1 R37.1 R40.1 R42.1 R43.1 R44.1 R50.1 R52.1 R54.2 R55.2 R56.1 R57.1 S1.P$1 S2.P$1 S3.P$1 S4.P$1 S5.P$1 S7.P$1 U1.79(K:AGND) U1.EP(K:GND) U2.9(PGND2) U2.16(PGND3) U2.22(AGND) U2.46(PGND1) U2.EP(GND) U3.1(GND) U4.13(GND) U4.21(GND) U4.22(GND) U5.2(AGND) U6.2(GND) U7.2(GND) U8.4(AGND) U8.5(SYNC) U9.6(A:CTL3/A3/DK3) U9.7(A:CTL2/A2/DK2) U9.8(A:CTL1/A1/DK1) U9.10(A:!PD) U9.16(A:DGND) U9.17(A:PGND) U9.20(A:TGND) U9.26(A:TGND) U9.32(A:TGND) U9.34(A:RESERVED) U9.35(A:DKEN) U9.42(C:D17) U9.43(C:D16) U9.48(A:DGND) U9.52(C:D9) U9.53(C:D8) U9.56(C:IDCK-) U9.62(C:D1) U9.63(C:D0) U9.64(A:DGND) U9.EP(A:EP) U10.7(VSSRX) U10.14(VSSTX) U10.17(VSSPLL) U10.18(VSSOSC) U10.26(VSS) U10.EP(VSS) U11.13(VSS) U11.36(VSS) U12.5(A:GND) U12.24(A:GND) U12.43(A:GND) U12.48(A:MODE) U13.5(GND) U14.1(A:GND) U14.EP(A:GND) U15.1(A:GND) U15.EP(A:GND) U16.1(A:GND) U16.EP(A:GND) U19.2(GND) U20.2(GND) U21.2(GND) U$4.A1(VSS) U$4.A8(VSS) U$4.B1(VSS) U$4.B2(VSSQ) U$4.B8(VSSQ) U$4.C9(VSSQ) U$4.D1(VSSQ) U$4.D8(VSS) U$4.D9(VSSQ) U$4.F2(VSS) U$4.F8(VSS) U$4.H2(!CS) U$4.J1(VSS) U$4.J9(VSS) U$4.L1(VSS) U$4.L9(VSS) U$4.N1(VSS) U$4.N9(VSS) U$5.A1(VSS) U$5.A8(VSS) U$5.B1(VSS) U$5.B2(VSSQ) U$5.B8(VSSQ) U$5.C9(VSSQ) U$5.D1(VSSQ) U$5.D8(VSS) U$5.D9(VSSQ) U$5.F2(VSS) U$5.F8(VSS) U$5.H2(!CS) U$5.J1(VSS) U$5.J9(VSS) U$5.L1(VSS) U$5.L9(VSS) U$5.N1(VSS) U$5.N9(VSS) Y1.2(GND) Y1.4(GND) Y2.2(GND) Y2.4(GND) Y3.2(GND) Y3.4(GND)
HTPLG: J5.19(HOTPLUG) R11.1
IPSOUT: C16.1 C17.1 C18.1 C19.1 C20.1 C21.1 C77.1 C78.1 JP2.3 L5.1 LED1.A S6.P$1 U2.7(VIN2) U2.13(LDO24IN) U2.14(VIN3) U2.21(APS) U2.34(IPSOUT) U2.35(IPSOUT) U2.40(LDO3IN) U2.44(VIN1) U5.6(VIN) U5.8(EN) U6.6(PVDD) U6.7(PVDD) U6.8(VDD) U7.6(PVDD) U7.7(PVDD) U7.8(VDD)
LX1: C23.1 C24.1 C28.1 L1.2 R19.1 U2.43(CHSENSE)
MSEN: R51.1 U1.103(I:PB2/EINT16) U9.11(A:MSEN/PO1)
N$1: C15.1 U1.92(L:X24MIN) Y1.3
N$2: D1.CATHODE R1.2
N$3: C1.1 R2.1 R7.1 U1.86(A:LRADC)
N$4: R2.2 R3.1 S1.P$2
N$5: R3.2 R4.1 S2.P$2
N$6: R4.2 R5.1 S3.P$2
N$7: R5.2 R6.1 S4.P$2
N$8: J1.2(TIP) RN12.5 U1.74(B:HPOUTL)
N$9: J1.3(RING) RN12.6 U1.78(B:HPOUTR)
N$10: J1.1(SLEEVE) RN12.7 U1.77(B:HPCOM)
N$11: C4.1 RN12.1
N$12: C5.1 RN12.2
N$13: C6.1 RN12.3
N$14: C7.1 C8.1 U1.75(B:HPBP)
N$15: C9.1 R12.1
N$16: C14.1 U1.91(L:X24MOUT) Y1.1
N$17: R18.2 S6.P$2 U2.4(!OE)
N$18: R22.2 U2.37(TS)
N$19: C25.1 U2.24(VREF)
N$20: R21.2 S7.P$2
N$21: LED1.C R20.2
N$22: R23.2 U2.23(BIAS)
N$23: L1.1 U2.45(LX1)
N$24: L2.1 U2.8(LX2)
N$25: J3.8(DAT1) R24.1 U1.107(J:SDC0_D1)
N$26: L3.1 U2.15(LX3)
N$27: J3.7(DAT0) R25.1 U1.108(J:SDC0_D0)
N$28: J3.5(CLK) U1.110(J:SDC0_CLK)
N$29: J3.3(CMD) R26.1 U1.111(J:SDC0_CMD)
N$30: J3.2(DAT3) R27.1 U1.112(J:SDC0_D3)
N$31: J3.1(DAT2) R28.1 U1.113(J:SDC0_D2)
N$32: C49.1 U1.83(K:VRA1)
N$33: C33.1 C34.1 J3.4(VCC) L4.2
N$34: C47.1 C48.1 R30.2 U1.82(K:VRA2)
N$35: R20.1 U2.36(CHGLED)
N$36: C53.1 C54.1 U1.80(K:VRP)
N$37: JP2.2 U5.7(DITH)
N$38: D2.2 L5.2 U5.4(SW)
N$39: R31.1 R32.2 U5.1(FB)
N$40: C65.1 C66.1 D2.1 Q1.3(D) R31.2
N$41: R43.2 U$4.H8(ZQ)
N$42: R33.2 U6.1(SHDN/RT)
N$43: C67.1 R34.1
N$44: R34.2 U6.10(COMP)
N$45: R37.2 U7.1(SHDN/RT)
N$46: C68.1 R38.1
N$47: R38.2 U7.10(COMP)
N$48: L7.1 U7.3(SW) U7.4(SW)
N$49: C79.1 C80.1 C107.+ J4.PWR U8.1(VIN_A) U8.2(EN) U8.6(VIN_SW)
N$50: C69.1 R39.1 R40.2 U7.9(FB)
N$51: L6.1 U6.3(SW) U6.4(SW)
N$52: L8.1 U8.7(SW)
N$53: C70.1 R35.1 R36.2 U6.9(FB)
N$54: C81.1 C82.1 D3.A L8.2 Q1.1(G) R41.2
N$55: R41.1 R42.2 U8.3(FB)
N$56: RN1.5 U1.22(D:DDR3_D0)
N$57: RN1.6 U1.21(D:DDR3_D2)
N$58: RN1.8 U1.19(D:DDR3_D4)
N$59: RN1.7 U1.20(D:DDR3_D6)
N$60: RN2.5 U1.39(D:DDR3_D10)
N$61: RN2.6 U1.38(D:DDR3_D14)
N$62: RN2.7 U1.37(D:DDR3_D8)
N$63: RN2.8 U1.36(D:DDR3_D12)
N$64: RN3.8 U1.40(D:DDR3_D1)
N$65: RN3.7 U1.41(D:DDR3_D3)
N$66: RN3.5 U1.44(D:DDR3_D5)
N$67: RN3.6 U1.42(D:DDR3_D7)
N$68: RN4.6 U1.26(D:DDR3_D13)
N$69: RN4.5 U1.27(D:DDR3_D15)
N$70: RN4.8 U1.24(D:DDR3_D11)
N$71: RN4.7 U1.25(D:DDR3_D9)
N$72: RN5.5 U1.64(D:DDR3_A0)
N$73: RN5.6 U1.63(D:DDR3_BA0)
N$74: RN5.7 U1.61(D:DDR3_BA2)
N$75: RN5.8 U1.60(D:DDR3_WE)
N$76: RN6.5 U1.55(D:DDR3_A8)
N$77: RN6.6 U1.54(D:DDR3_A6)
N$78: RN6.8 U1.51(D:DDR3_A4)
N$79: RN6.7 U1.52(D:DDR3_A1)
N$80: RN7.8 U1.47(D:DDR3_CKE)
N$81: RN7.5 U1.50(D:DDR3_A12)
N$82: RN7.7 U1.48(D:DDR3_A10)
N$83: RN7.6 U1.49(D:DDR3_BA1)
N$84: RN8.7 U1.66(D:DDR3_A2)
N$85: RN8.8 U1.65(D:DDR3_A3)
N$86: RN8.6 U1.67(D:DDR3_A5)
N$87: RN8.5 U1.68(D:DDR3_A13)
N$88: RN9.8 U1.56(D:DDR3_A11)
N$89: RN9.7 U1.57(D:DDR3_A14)
N$90: RN9.6 U1.58(D:DDR3_RAS)
N$91: RN9.5 U1.59(D:DDR3_CAS)
N$92: RN10.6 U1.71(D:DDR3_A7)
N$93: RN10.8 U1.69(D:DDR3_A9)
N$94: RN10.7 U1.70(D:DDR3_RST)
N$95: RN10.5 U1.72(D:DDR3_ODT)
N$96: RN11.8 U1.31(D:DDR3_DQS0+)
N$97: RN11.7 U1.32(D:DDR3_DQS0-)
N$98: RN11.6 U1.33(D:DDR3_DQS1+)
N$99: RN11.5 U1.34(D:DDR3_DQS1-)
N$100: R46.2 U1.45(D:DDR3_CK+)
N$101: R47.2 U1.46(D:DDR3_CK-)
N$102: R49.2 U1.28(D:DDR3_DM1)
N$103: R48.2 U1.29(D:DDR3_DM0)
N$104: R50.2 U$5.H8(ZQ)
N$105: U1.130(H:LCD_D23) U9.36(C:D23)
N$106: U1.131(H:LCD_D22) U9.37(C:D22)
N$107: U1.132(H:LCD_D21) U9.38(C:D21)
N$108: U1.133(H:LCD_D20) U9.39(C:D20)
N$109: U1.134(H:LCD_D19) U9.40(C:D19)
N$110: U1.135(H:LCD_D18) U9.41(C:D18)
N$111: U1.136(H:LCD_D15) U9.44(C:D15)
N$112: U1.137(H:LCD_D14) U9.45(C:D14)
N$113: U1.138(H:LCD_D13) U9.46(C:D13)
N$114: U1.139(H:LCD_D12) U9.47(C:D12)
N$115: U1.140(H:LCD_D11) U9.50(C:D11)
N$116: U1.141(H:LCD_D10) U9.51(C:D10)
N$117: U1.143(H:LCD_D7) U9.54(C:D7)
N$118: U1.144(H:LCD_D6) U9.55(C:D6)
N$119: U1.145(H:LCD_D5) U9.58(C:D5)
N$120: U1.146(H:LCD_D4) U9.59(C:D4)
N$121: U1.147(H:LCD_D3) U9.60(C:D3)
N$122: U1.148(H:LCD_D2) U9.61(C:D2)
N$123: U1.129(H:LCD_CLK) U9.57(C:IDCK+)
N$124: U1.128(H:LCD_DE) U9.2(C:DE)
N$125: U1.127(H:LCD_HSYNC) U9.4(C:HSYNC)
N$126: U1.126(H:LCD_VSYNC) U9.5(C:VSYNC)
N$127: R9.1 U9.19(A:TFADJ)
N$128: R10.1 U9.13(A:ISEL/!RST)
N$129: R11.2 U9.9(A:EDGE/HTPLG)
N$138: C109.1 U10.19(OSC1) Y2.3
N$139: C108.1 U10.20(OSC2) Y2.1
N$140: R52.2 U10.10(RBIAS)
N$141: C110.1 U10.25(VCAP)
N$142: R53.1 U10.6(!RESET)
N$143: J6.L4(GREEN:C) R55.1
N$144: J6.L2(YELLOW:C) R54.1
N$145: J6.L3(GREEN:A) U10.23(LEDA)
N$146: J6.L1(YELLOW:A) U10.22(LEDB)
N$147: J6.1(A:R1) R58.1 U10.13(TPOUT+)
N$148: J6.2(A:R2) R59.1 U10.12(TPOUT-)
N$149: J6.7(A:R7) R56.2 U10.9(TPIN+)
N$150: J6.8(A:R8) R57.2 U10.8(TPIN-)
N$151: C111.1 J6.3(A:R3) L9.1 R58.2 R59.2
N$152: U1.118(E:!DQ0!/SDC2_D0) U11.29(D0)
N$153: U1.119(E:!DQ1!/SDC2_D1) U11.30(D1)
N$154: U1.120(E:!DQ2!/SDC2_D2) U11.31(D2)
N$155: U1.121(E:!DQ3!/SDC2_D3) U11.32(D3)
N$156: U1.122(E:!DQ4!/SDC2_D4) U11.41(D4)
N$157: U1.123(E:!DQ5!/SDC2_D5) U11.42(D5)
N$158: U1.124(E:!DQ6!/SDC2_D6) U11.43(D6)
N$159: U1.125(E:!DQ7!/SDC2_D7) U11.44(D7)
N$160: R60.1 U1.176(E:!RB0!/SDC2_CMD) U11.7(R/!B)
N$161: R61.1 U1.2(E:!CE0) U11.9(!CE)
N$162: U1.8(E:!WE!/SPI0_MOSI) U11.18(!WE)
N$163: U1.1(E:!RE) U11.8(!RE)
N$164: U1.7(E:!ALE!/SPI0_MISO) U11.17(ALE)
N$165: U1.6(E:!CLE!/SPI0_CLK) U11.16(CLE)
N$166: C112.1 R62.1 U11.19(!WP)
N$167: JP3.1 U1.90(F:TPY1)
N$168: JP3.2 U1.89(F:TPX1)
N$169: JP3.3 U1.88(F:TPY2)
N$170: JP3.4 U1.87(F:TPX2)
N$171: U12.11(B:!PWRON1) U14.3(A:!EN)
N$172: U12.12(B:!OVRCUR1) U14.8(A:!OC)
N$173: J9.10(C:D-) RN15.7
N$174: J9.11(C:D+) RN15.8
N$175: J9.6(B:D-) RN15.5
N$176: J9.7(B:D+) RN15.6
N$177: J9.3(A:D+) RN14.8
N$178: J9.2(A:D-) RN14.7
N$179: U12.19(D:!PWRON3) U15.3(A:!EN)
N$180: U12.20(D:!OVRCUR3) U15.8(A:!OC)
N$181: U12.15(C:!PWRON2) U14.4(B:!EN)
N$182: U12.16(C:!OVRCUR2) U14.5(B:!OC)
N$183: C121.+ J8.5(B:VBUS) U14.6(B:OUT)
N$184: C120.+ J8.1(A:VBUS) U14.7(A:OUT)
N$185: C122.+ J8.9(C:VBUS) U15.7(A:OUT)
N$186: J8.11(C:D+) RN14.6
N$187: J8.10(C:D-) RN14.5
N$188: U12.25(E:!OVRCUR4) U15.5(B:!OC)
N$189: U12.23(E:!PWRON4) U15.4(B:!EN)
N$190: C123.+ J9.1(A:VBUS) U15.6(B:OUT)
N$191: J8.7(B:D+) RN13.8
N$192: J8.6(B:D-) RN13.7
N$193: U12.28(F:!PWRON5) U16.3(A:!EN)
N$194: U12.29(F:!OVRCUR5) U16.8(A:!OC)
N$195: C124.+ J9.5(B:VBUS) U16.7(A:OUT)
N$196: J8.3(A:D+) RN13.6
N$197: J8.2(A:D-) RN13.5
N$198: C125.+ J9.9(C:VBUS) U16.6(B:OUT)
N$199: U12.32(G:!PWRON6) U16.4(B:!EN)
N$200: U12.33(G:!OVRCUR6) U16.5(B:!OC)
N$201: C130.1 U12.44(A:XTAL2) Y3.3
N$202: C129.1 U12.45(A:XTAL1) Y3.1
N$203: J7.D+ R65.2
N$204: J7.D- R66.2
N$205: R67.2 R69.1 U12.3(A:DP0)
N$206: R68.2 U12.4(A:DM0)
N$207: R69.2 U12.2(A:DP0PUR)
OTG_PWR: R12.2 U2.31(VBUS)
PWRON: C27.1 R21.1 U2.47(PWRON)
SCL: J5.15(SCL) R14.1 U1.101(G:TWI0_SCK) U2.2(SCK) U9.15(A:BSEL/SCL)
SDA: J5.16(SDA) R13.1 U1.102(G:TWI0_SDA) U2.1(SDA) U9.14(A:DSEL/SDA)
SDC0_CD: J3.CD1(CD) R29.1 U1.155(I:PG0/EINT0)
T0_N: J5.9(TX0-) U9.24(B:TX0-)
T0_P: J5.7(TX0+) U9.25(B:TX0+)
T1_N: J5.6(TX1-) U9.27(B:TX1-)
T1_P: J5.4(TX1+) U9.28(B:TX1+)
T2_N: J5.3(TX2-) U9.30(B:TX2-)
T2_P: J5.1(TX2+) U9.31(B:TX2+)
TC_N: J5.12(TXC-) U9.21(B:TXC-)
TC_P: J5.10(TXC+) U9.22(B:TXC+)
UART1_RX: U1.165(C:CSI_D7/UART1_RX) U4.1(TX) U13.4(TX)
UART1_TX: U1.166(C:CSI_D6/UART1_TX) U4.2(RX) U13.3(RX)
UBOOT: R6.2 S5.P$2 U1.157(A:UBOOT)
VINT: C26.1 U2.26(VINT) U2.27(LDO1SET)
VUSB: C12.+ C13.1 J7.VBUS R16.2 U3.6(OUT) U3.7(OUT)
VUSBDET: R16.1 R17.2 U1.154(I:PG1/EINT1)
VUSBFLG: R15.1 U1.14(I:PG11/SPI1_MOSI/UART3_CTS/EINT11) U3.5(FLG)
Unconnected: J2.NC1(PAD1) J2.NC2(PAD2) J5.14(RESERVED) R63.1 R63.2 R64.1 R64.2 RN12.4 RN12.8 U1.3(E:!CE1!/SPI0_CS0) U1.10(I:PB10/EINT24) U1.12(I:PG9/SPI1_CS0/UART3_TX/EINT9) U1.13(I:PG10/SPI1_CLK/UART3_RX/EINT10) U1.17(I:DZQ) U1.18(I:SVREF) U1.84(B:MIC_IN1) U1.85(B:V_MIC) U1.151(I:PG4/UART1_RX/EINT4) U1.152(I:PG3/UART1_TX/EINT3) U1.153(I:PG2/EINT2) U1.160(I:PB18) U1.161(I:PB17) U1.162(E:!QDS) U1.167(C:CSI_D5/SDC2_CLK) U1.168(C:CSI_D4/SDC2_CMD) U1.170(C:CSI_D3/SDC2_D3) U1.171(C:CSI_D2/SDC2_D2) U1.172(C:CSI_D1/SDC2_D1) U1.174(C:CSI_D0/SDC2_D0) U1.175(E:!RB1!/SDC2_CLK) U2.3(GPIO3) U2.5(GPIO2) U2.11(LDO4) U2.18(GPIO1) U2.19(GPIO0) U2.28(LDO1) U2.29(DC3SET) U2.30(BACKUP) U4.3(CTS) U4.4(RTS) U4.5(PCM_CLK) U4.6(PCM_OUT) U4.7(PCM_IN) U4.8(PCM_SYNC) U4.9(AIO0) U4.10(AIO1) U4.11(RESET) U4.15(D-) U4.16(CSB) U4.17(MOSI) U4.18(MISO) U4.19(SCK) U4.20(D+) U4.23(PIO0) U4.24(PIO1) U4.25(PIO2) U4.26(PIO3) U4.27(PIO4) U4.28(PIO5) U4.29(PIO6) U4.30(PIO7) U4.31(PIO8) U4.32(PIO9) U4.33(PIO10) U10.27(CLKOUT) U11.1(NC) U11.2(NC) U11.3(NC) U11.4(NC) U11.5(NC) U11.6(NC) U11.10(NC) U11.11(NC) U11.14(NC) U11.15(NC) U11.20(NC) U11.21(NC) U11.22(NC) U11.23(NC) U11.24(NC) U11.25(NC) U11.26(NC) U11.27(NC) U11.28(NC) U11.33(NC) U11.34(NC) U11.35(NC) U11.38(NC) U11.39(NC) U11.40(NC) U11.45(NC) U11.46(NC) U11.47(NC) U11.48(NC) U12.1(A:SUSPND) U12.7(A:EECLK) U12.36(H:!PWRON7) U12.37(H:!OVRCUR7) U12.38(H:DM7) U12.39(H:DP7) U12.40(A:HUBCFG) U12.41(A:PORTPWR) U12.42(A:PORTDIS) U$4.A3(NC) U$4.A7(NF/!TDQS) U$4.F1(NC/ODT1) U$4.F9(NC/CKE1) U$4.H1(NC/!CS1) U$4.H9(NC/ZQ1) U$4.J7(NC/A15) U$5.A3(NC) U$5.A7(NF/!TDQS) U$5.F1(NC/ODT1) U$5.F9(NC/CKE1) U$5.H1(NC/!CS1) U$5.H9(NC/ZQ1) U$5.J7(NC/A15)

## Buses
DDR3_D[0..15]
DDR3_A[0..14]
DDR3_CK_P,DDR3_CK_N,DDR3_CKE,!DDR3_RAS!,!DDR3_CAS!,!DDR3_WE!,DDR3_RST,DDR3_ODT,DDR3_DM[0..1],DDR3_BA[0..2],DDR3_DQS0_P,DDR3_DQS0_N,DDR3_DQS1_P,DDR3_DQS1_N

## Notes on the sheet
- 0.98V | 0.80V | 0.60V | 0.39V | 0.19V
- David Freitag | A
- Vout = 0.8 * (1 + R1/R2)
- Vout = 0.8 * (R1 + R2) / R2
- R2 = R1 / ((Vout / 1.24) - 1)
- David Freitag
- Vout = 0.8 * (R1 + R2) / R2
- David Freitag
- David Freitag
- David Freitag

## Library data of the parts
C1-C11 C13-C106 C108-C119 C126-C130 = SparkFun-Passives:CAP: Capacitor Standard 0603 ceramic capacitor, and 0.1" leaded capacitor.
C12 C107 C120-C125 = Passives:CAP_POL; PARTNUM: 493-7371-1-ND
D1 = Generic:1N5819
D2 = Passives:DIODE
D3 = Diodes:B340-13-F
J1 = CUI inc:SJ-2523-SMT-TR
J2 = SparkFun-Connectors:JST_2MM_MALE: Mates to single-cell LiPo batteries. CONN-08352; PROD_ID: CONN-08352
J3 = SparkFun-Connectors:MICRO-SD
J4 = SparkFun-Connectors:POWER_JACK: Power Jack This is the standard 5.5mm barrel jack for power. The PTH is the most common, proven, reliable, footprint. The Slot footprint only works if the mill layer is transmitted to the PCB fab house so be warned. Mating wall wart : TOL-00298 (and others); PROD_ID: PRT-00119
J5 = FCI:HDMI
J6 = Connectors:RB1-125BAG1A
J7 = SparkFun-Connectors:USB+SHIELD: USB+Shield USB connector with shield pins connectable
J8 J9 = Connectors:USB-STACKED
JP1 = SparkFun-Connectors:M02: Standard 2-pin 0.1" header. Use with - straight break away headers ( PRT-00116) - right angle break away headers (PRT-00553) - swiss pins (PRT-00743) - machine pins (PRT-00117) - female headers (PRT-00115) Molex polarized connector foot print use with: PRT-08233 with associated crimp pins and housings. 2.54_SCREWTERM for use with PRT-10571. 3.5mm Screw Terminal footprints for PRT-08084 5mm Screw Terminal footprints for use with PRT-08433
JP2 = SparkFun-Passives:JUMPER-3
JP3 = SparkFun-Connectors:M04: Header 4 Standard 4-pin 0.1" header. Use with straight break away headers (SKU : PRT-00116), right angle break away headers (PRT-00553), swiss pins (PRT-00743), machine pins (PRT-00117), and female headers (PRT-00115). Molex polarized connector foot print use with SKU : PRT-08231 with associated crimp pins and housings. 1MM SMD Version SKU: PRT-10208
L1-L3 L5-L8 = Taiyo Yuden:NR6028T4R7M
L4 L9 = SparkFun-Passives:INDUCTOR: Inductors Basic Inductor/Choke - 0603 and 1206. Footprints are not proven and vary greatly between part numbers. SRN6045- 33uH, 20% 1.4A SDR0403-560KL - 56uH, 10%, 500mA RMS/740mA peak
LED1 = SparkFun-LED:LED: LEDs Standard schematic elements and footprints for 5mm, 3mm, 1206, and 0603 sized LEDs. 5mm - Spark Fun Electronics SKU : COM-00529 (and others)
PT1-PT9 = SparkFun-Passives:2PT_GND_TIE: Package for connecting two ground nets in one place.
Q1 = Diodes:DMP3098L-7
R1-R69 = SparkFun-Passives:RESISTOR: Resistor Basic schematic elements and footprints for 0603, 1206, and PTH resistors.
RN1-RN15 = Passives:RESISTOR-NETWORK
S1-S7 = TE Connectivity:FSMSM
U1 = Allwinner:A13
U2 = X-Powers:AXP209
U3 = Diodes:AP2161DM8G-13
U4 = Passives:HC-05
U5 = Micrel:MIC2250YML
U6 U7 = Diodes:AP3409DNTR-G1
U8 = STMicroelectrionics:ST1S10PUR
U9 = TI:TFP410
U10 = Microchip:ENC28J60
U11 = Samsung:NAND
U12 = TI:TUSB2077
U13 = Passives:HC-05-EZ
U14-U16 = TI:TPS2042
U19-U21 = NXP:IP4220CZ6
U$4 U$5 = SK HYNIX:DDR3
Y1-Y3 = Passives:CRYSTAL